# EAGLE schematic Masters Project (EAGLE 9.4.2), part 2 of 2
## Sheet 25 of 35: Gerber: Board Outline
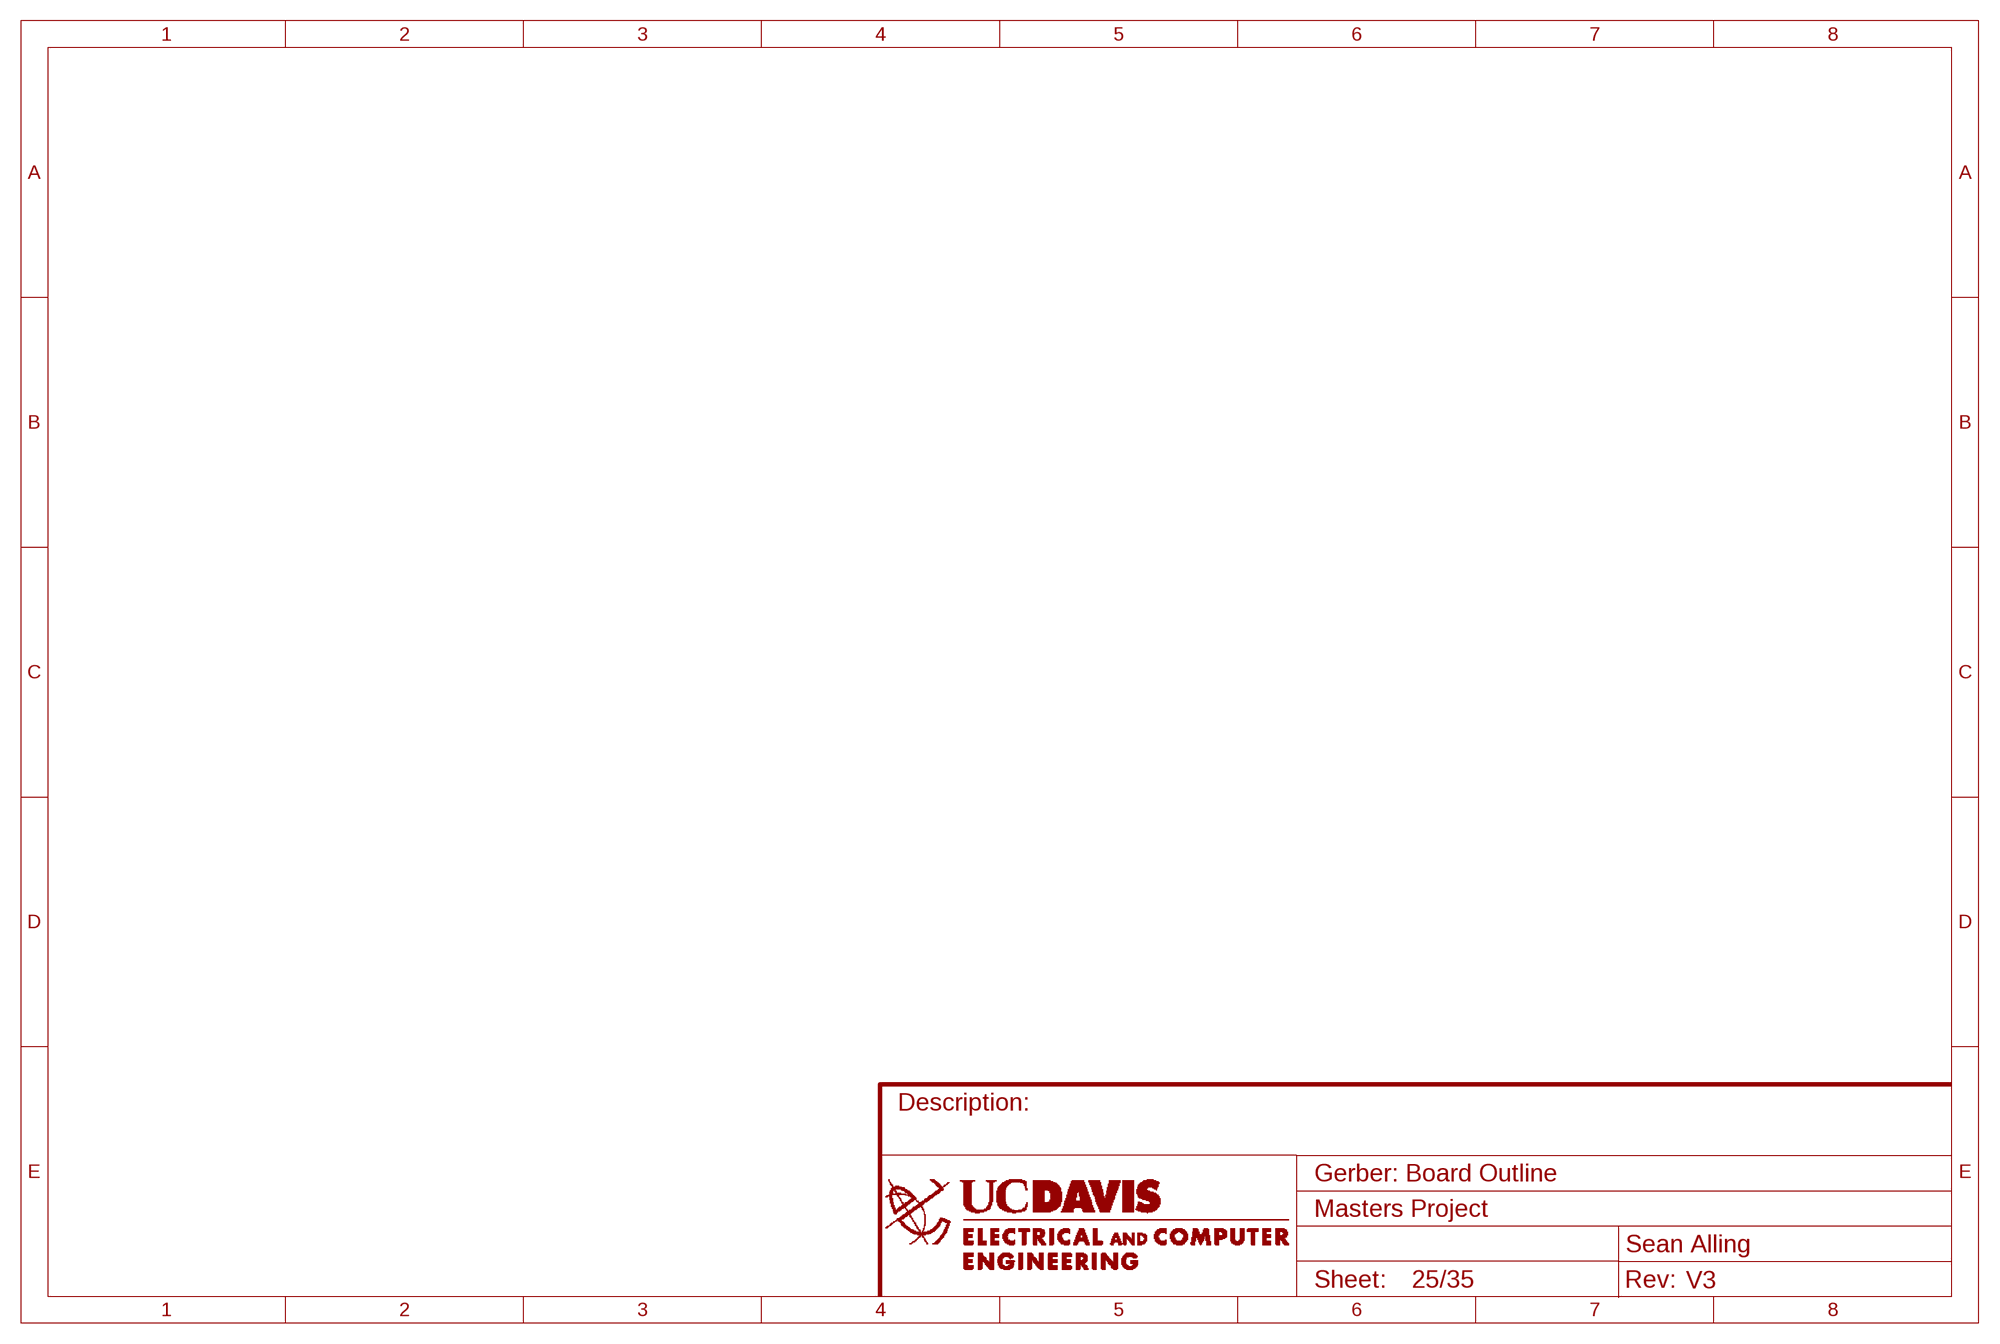
[diagram p24: schematic, sheet 25]

## Sheet 26 of 35: Gerber: Top Copper
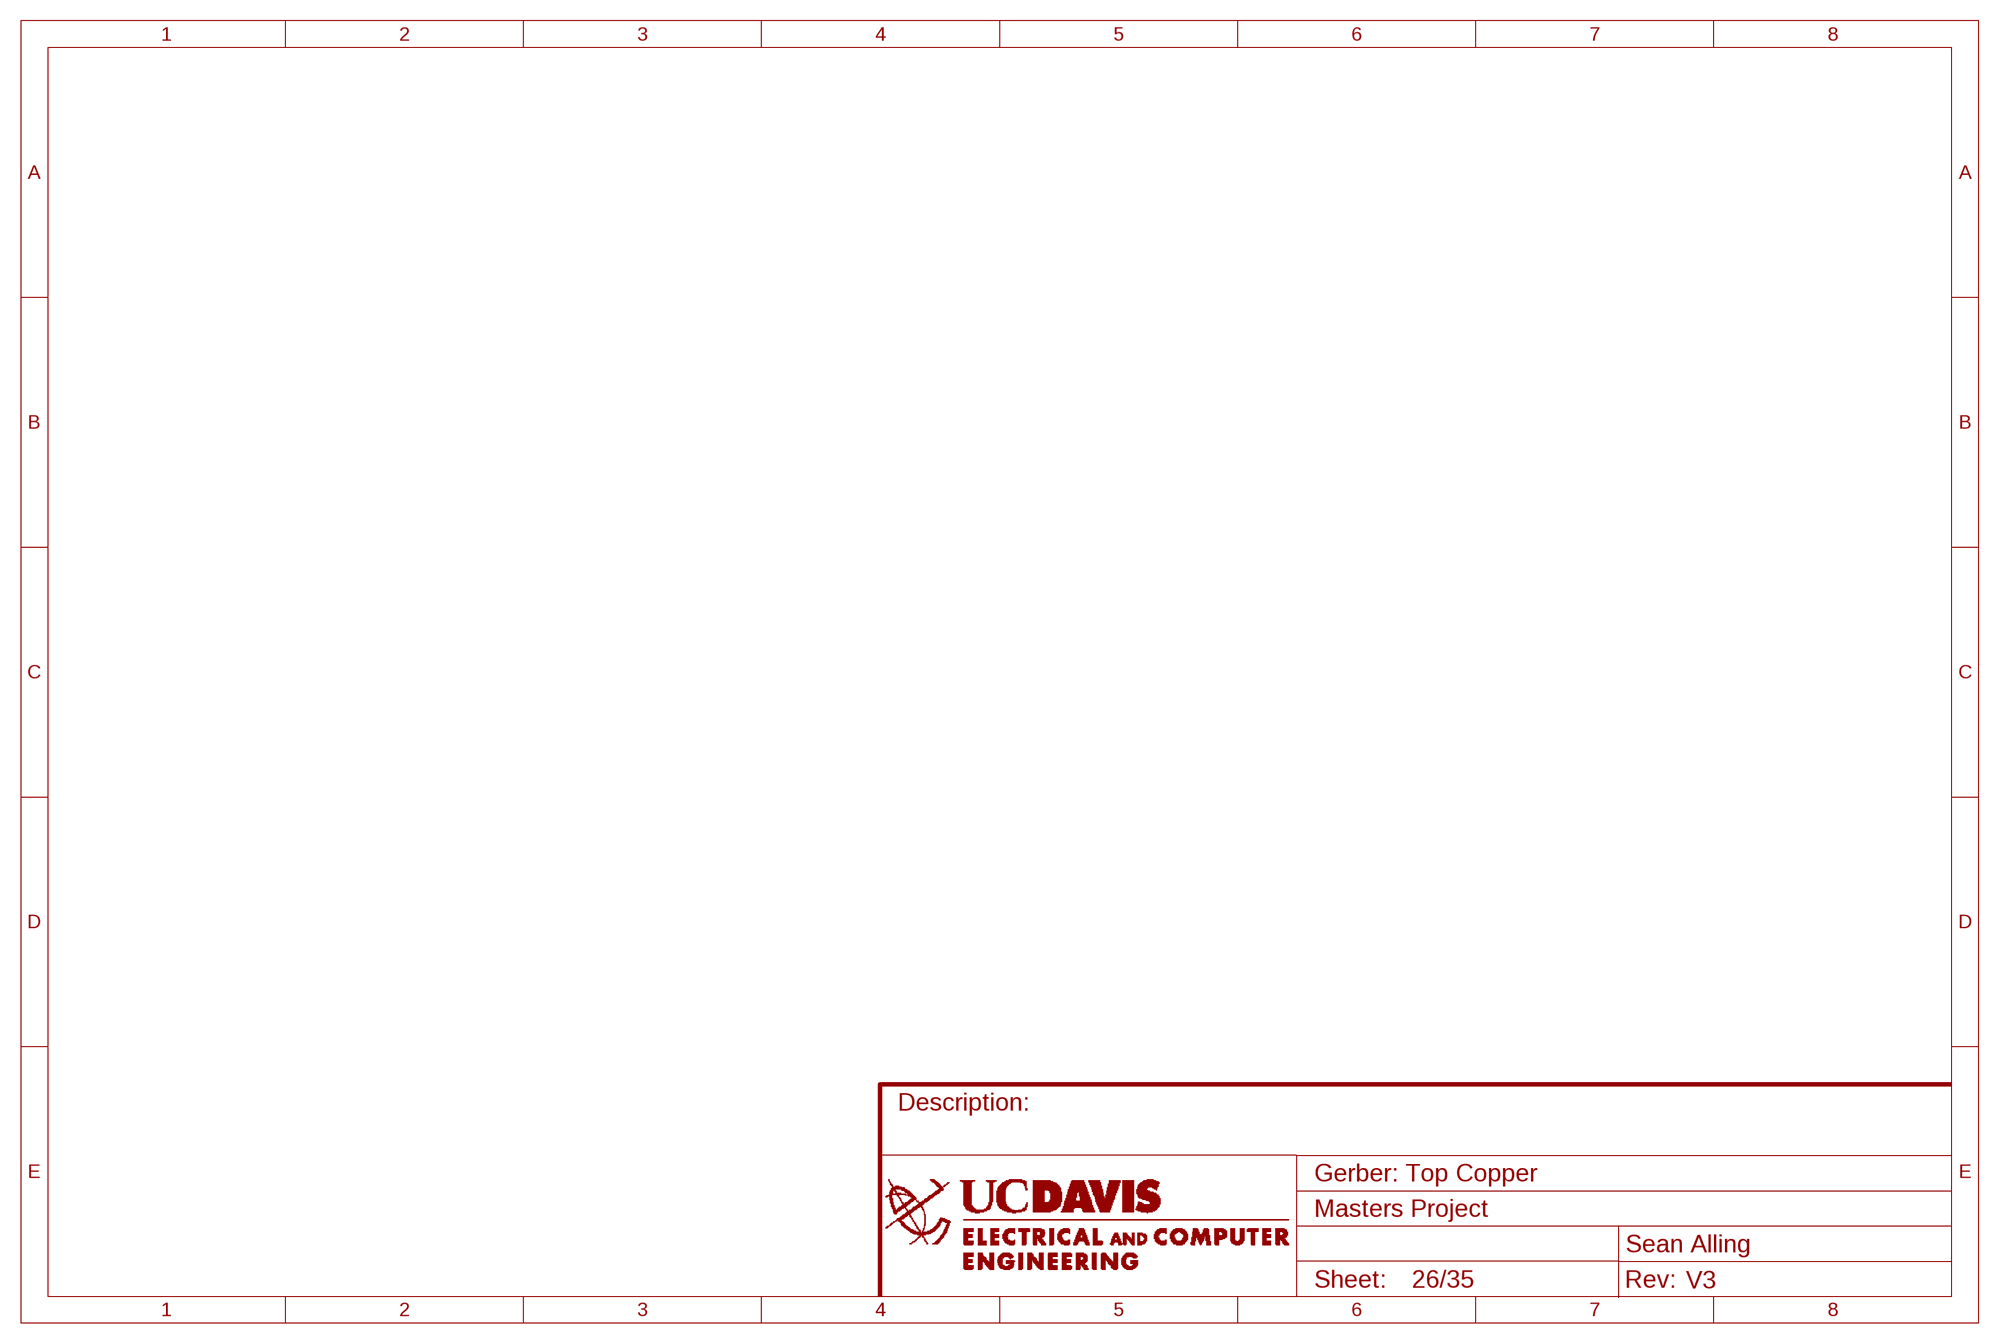
[diagram p25: schematic, sheet 26]

## Sheet 27 of 35: Gerber: Bottom Copper
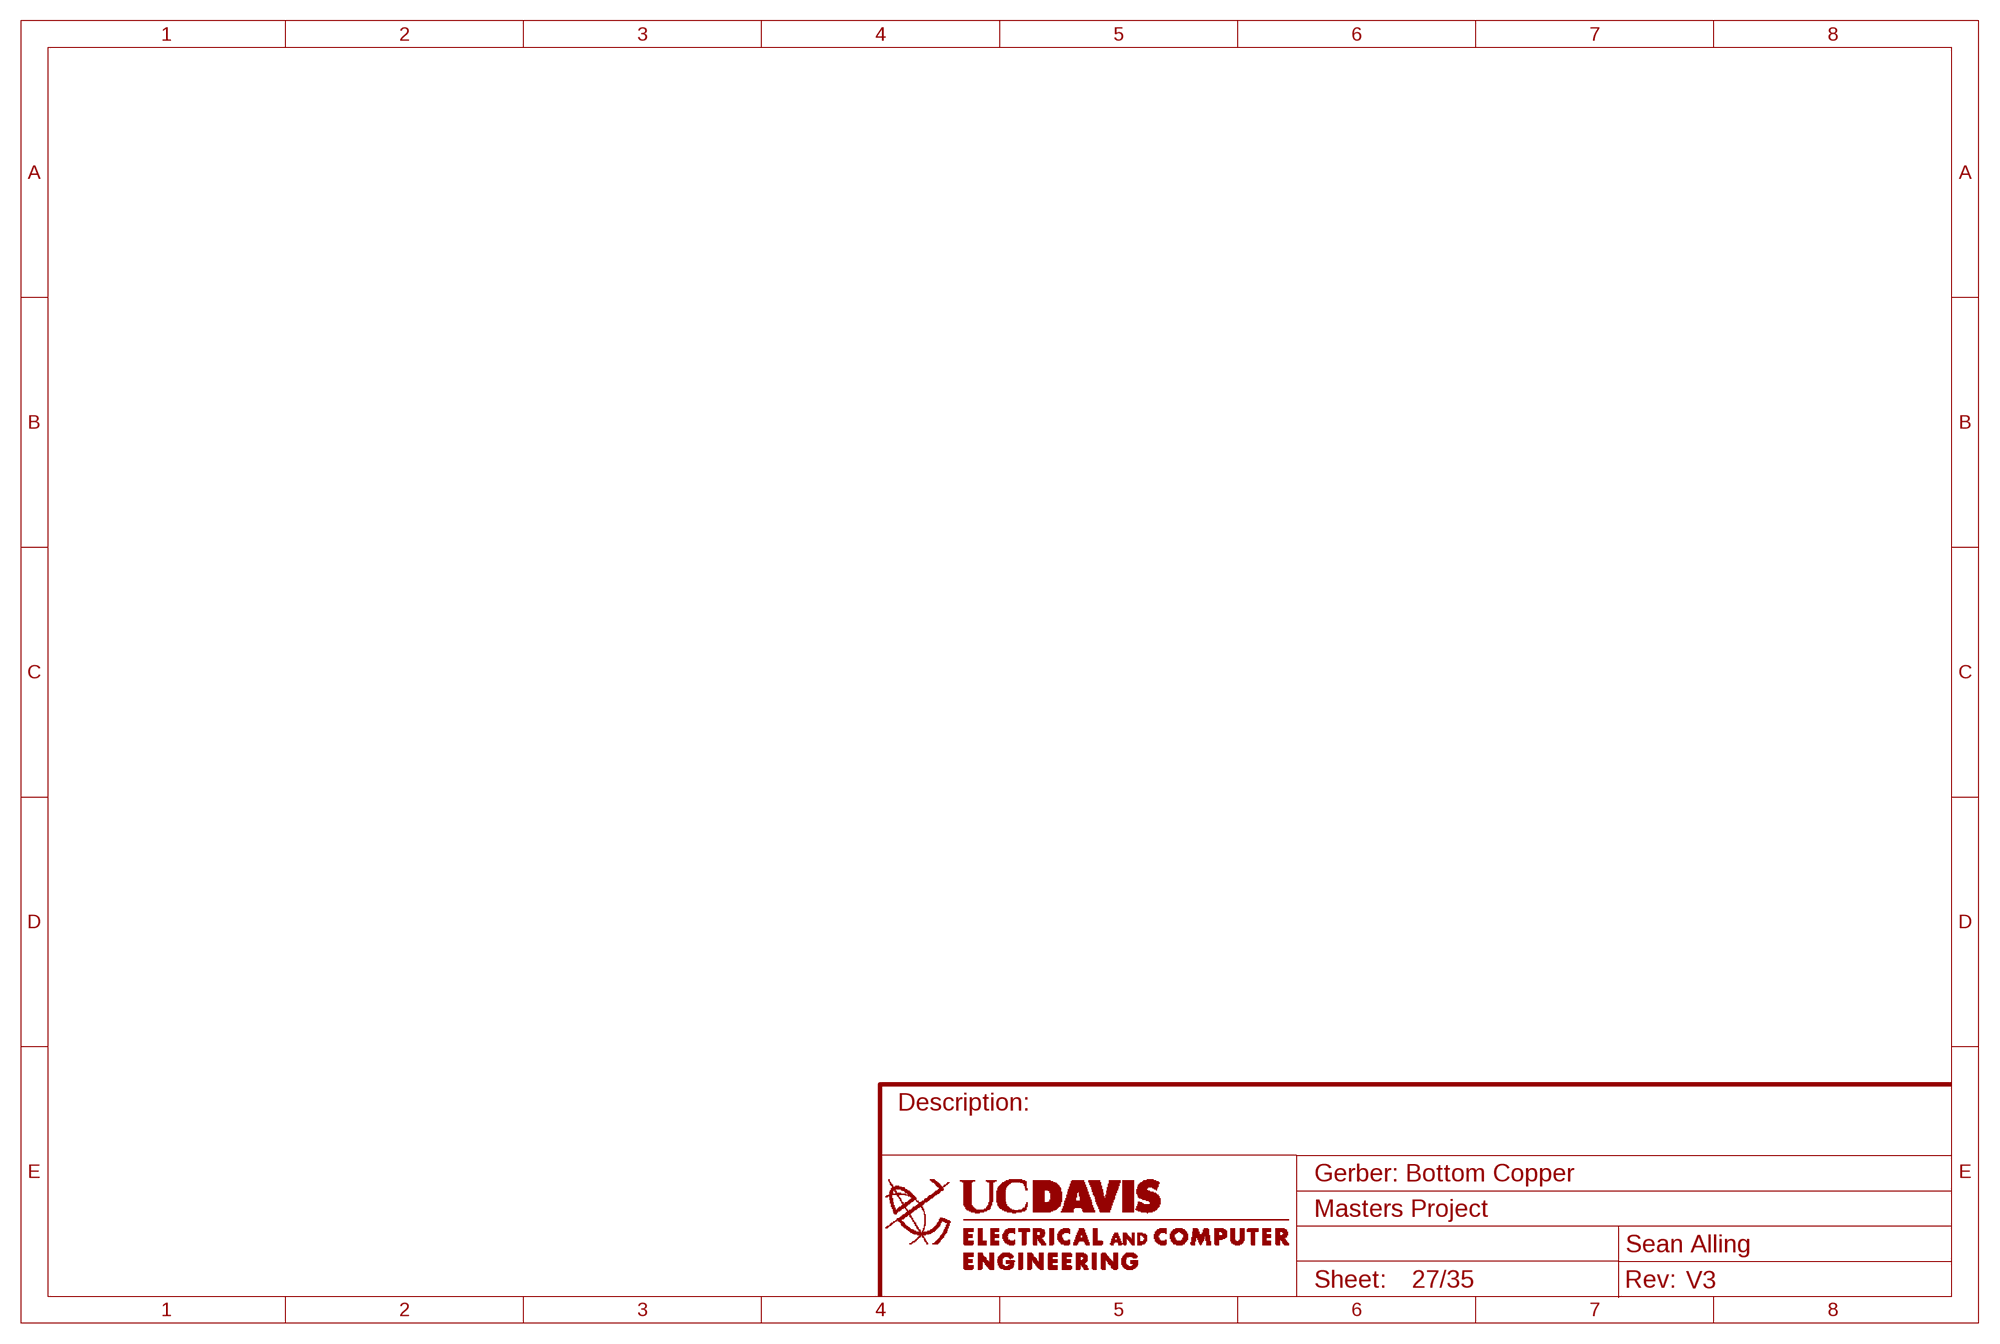
[diagram p26: schematic, sheet 27]

## Sheet 28 of 35: Gerber: Top Silkscreen
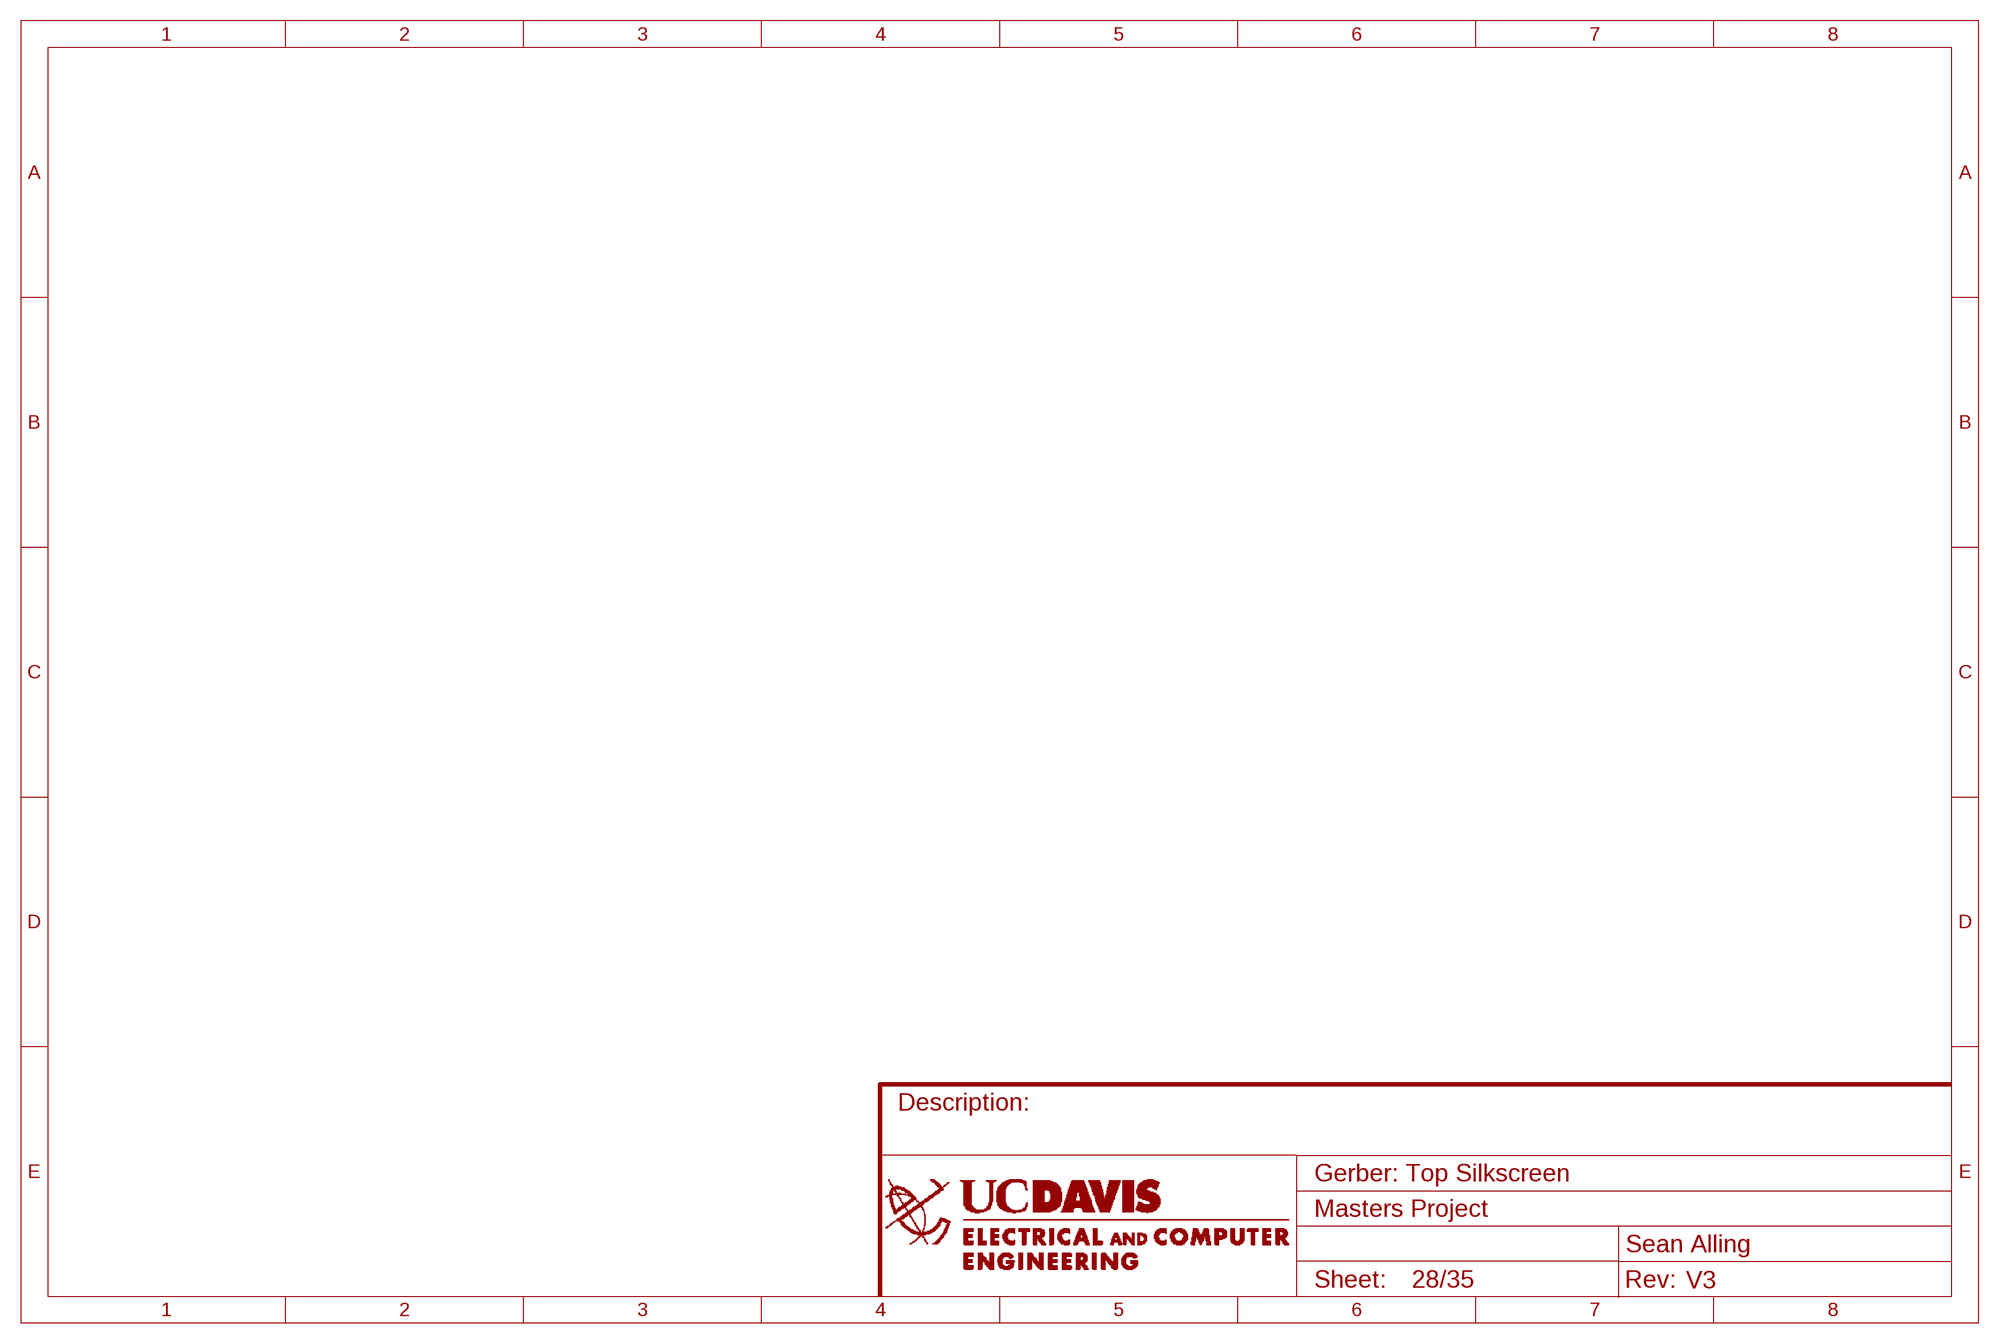
[diagram p27: schematic, sheet 28]

## Sheet 29 of 35: Gerber: Bottom Silkscreen
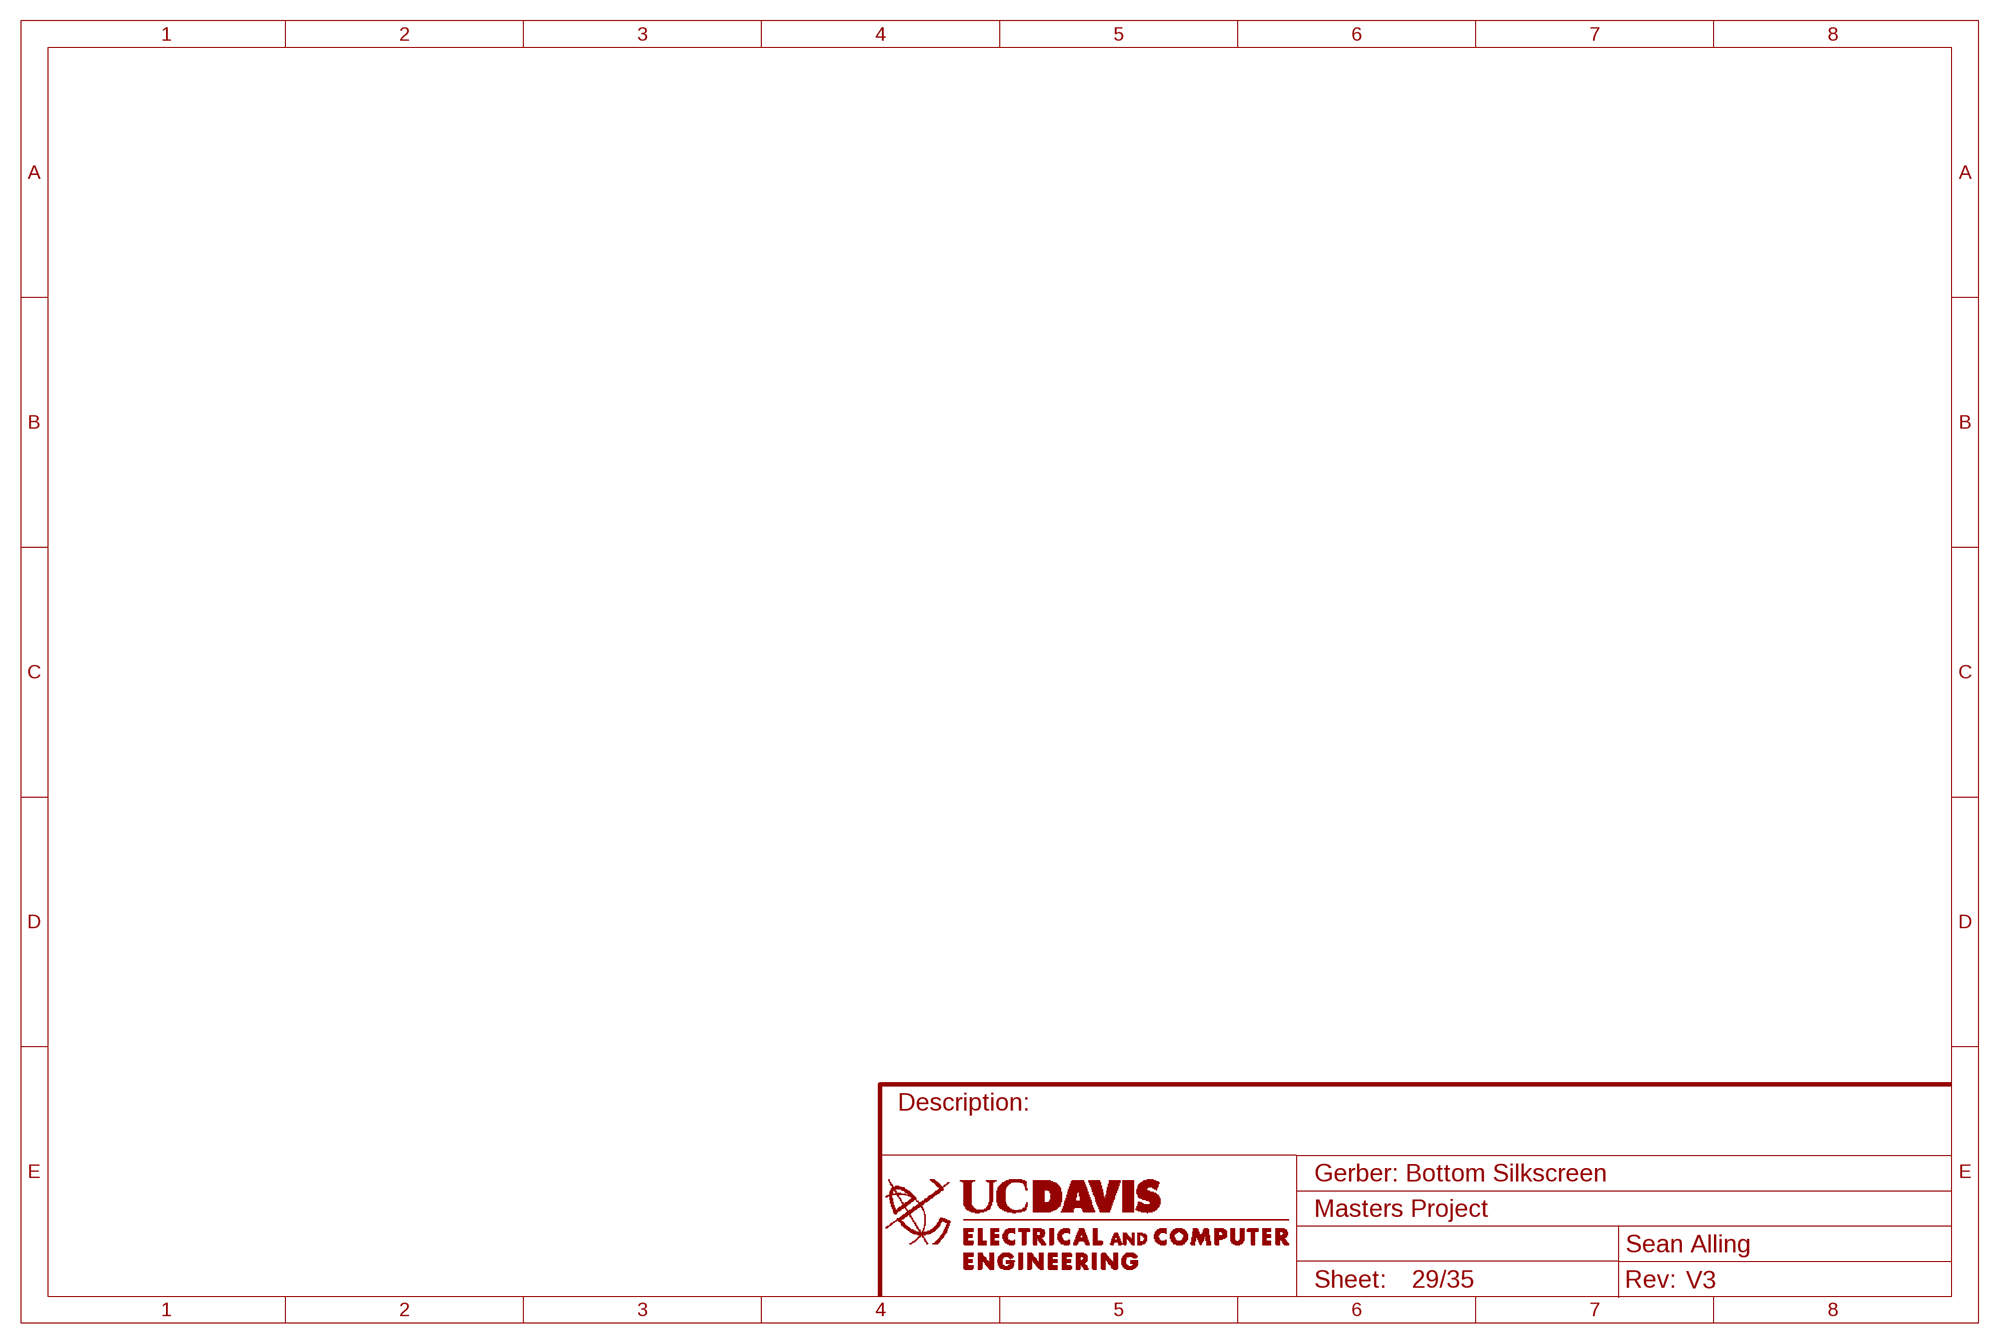
[diagram p28: schematic, sheet 29]

## Sheet 30 of 35: Gerber: Top Soldermask
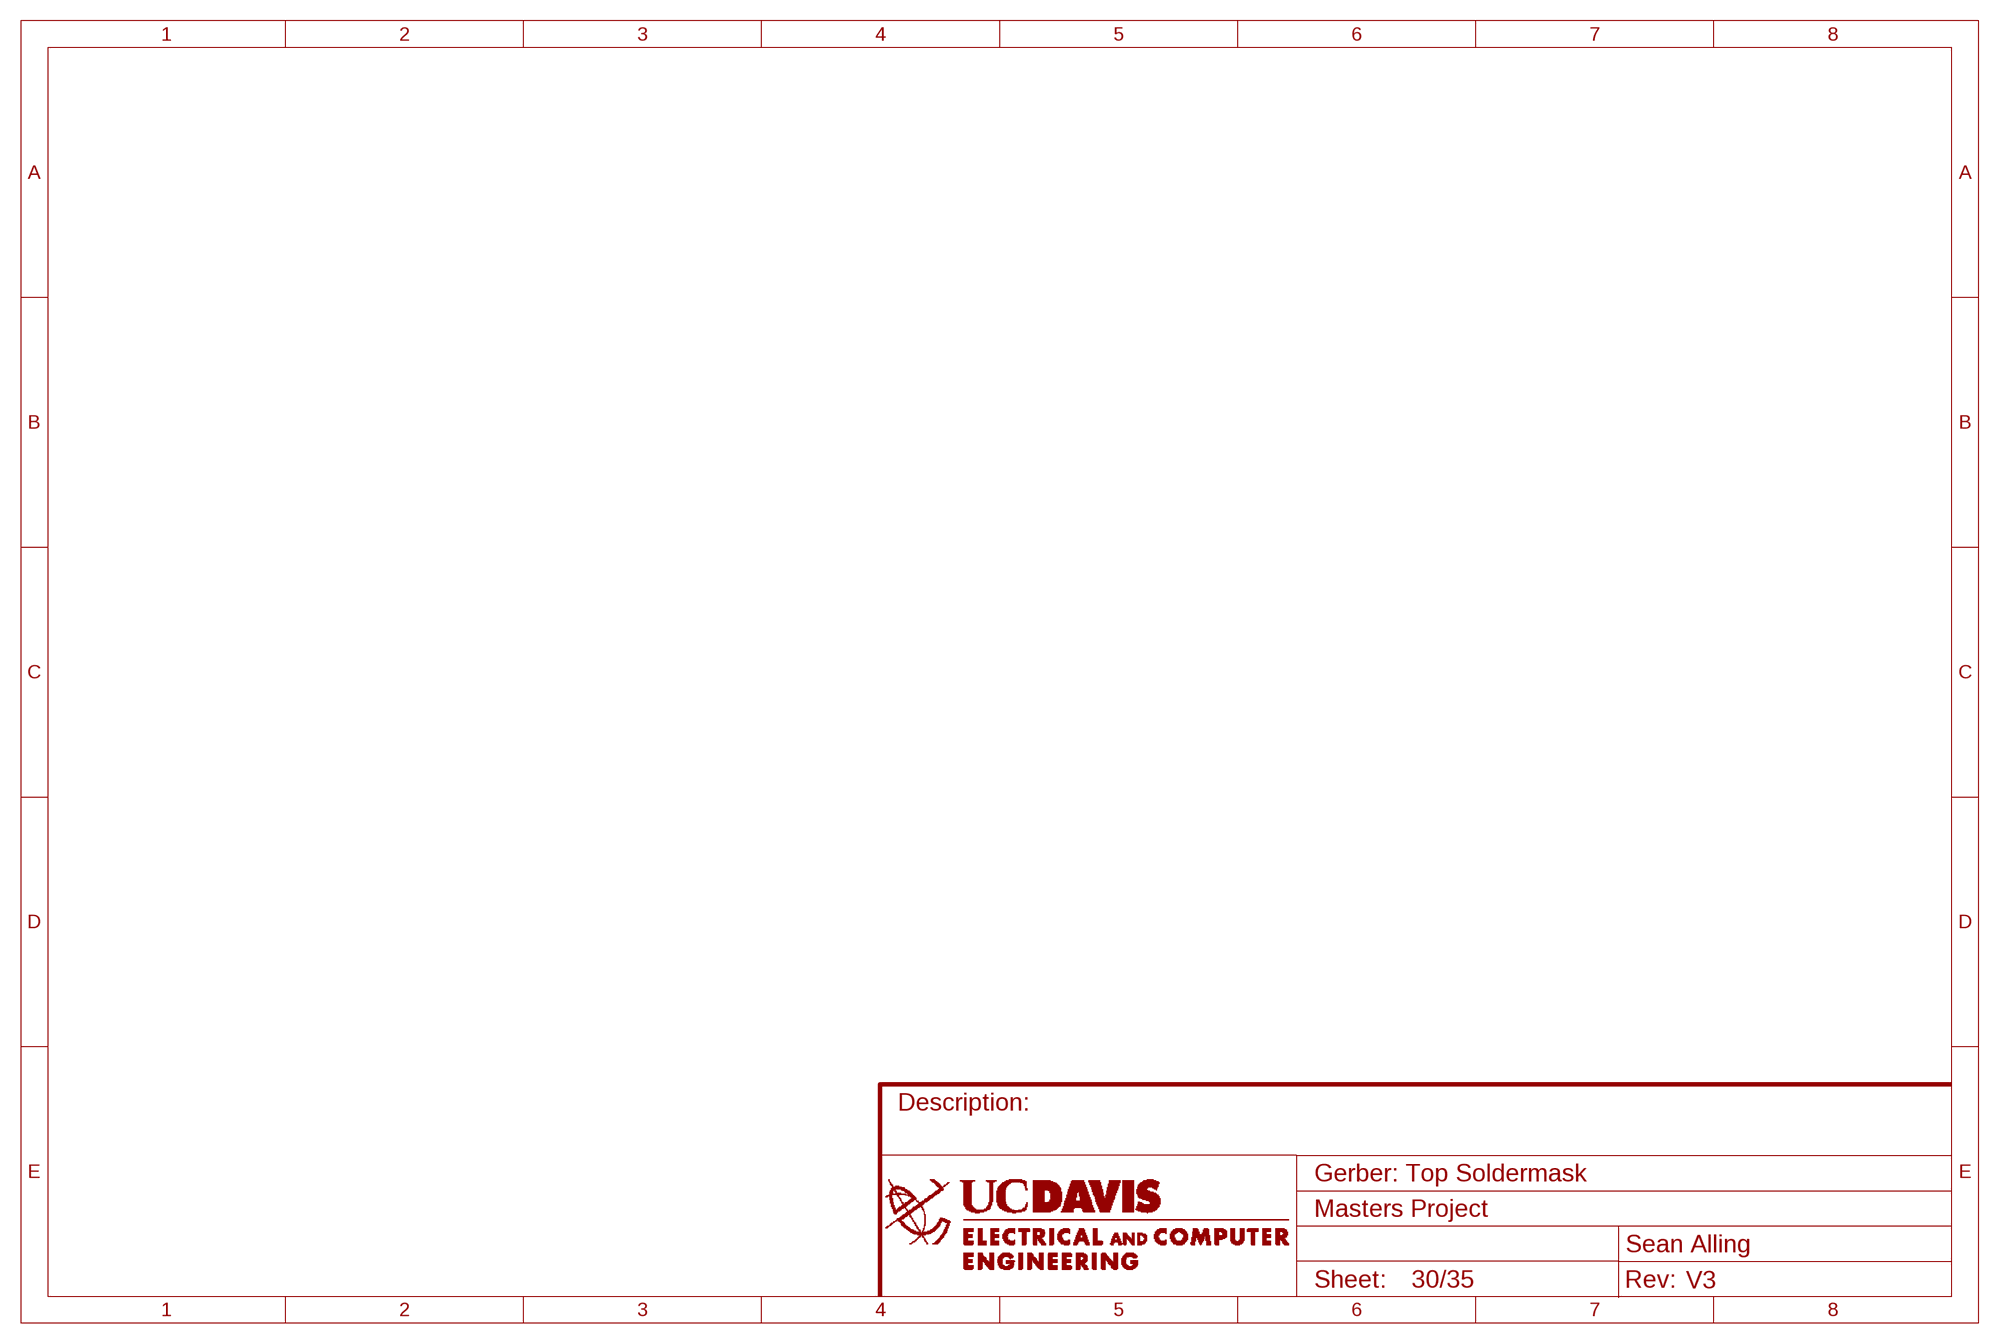
[diagram p29: schematic, sheet 30]

## Sheet 31 of 35: Gerber: Bottom Soldermask
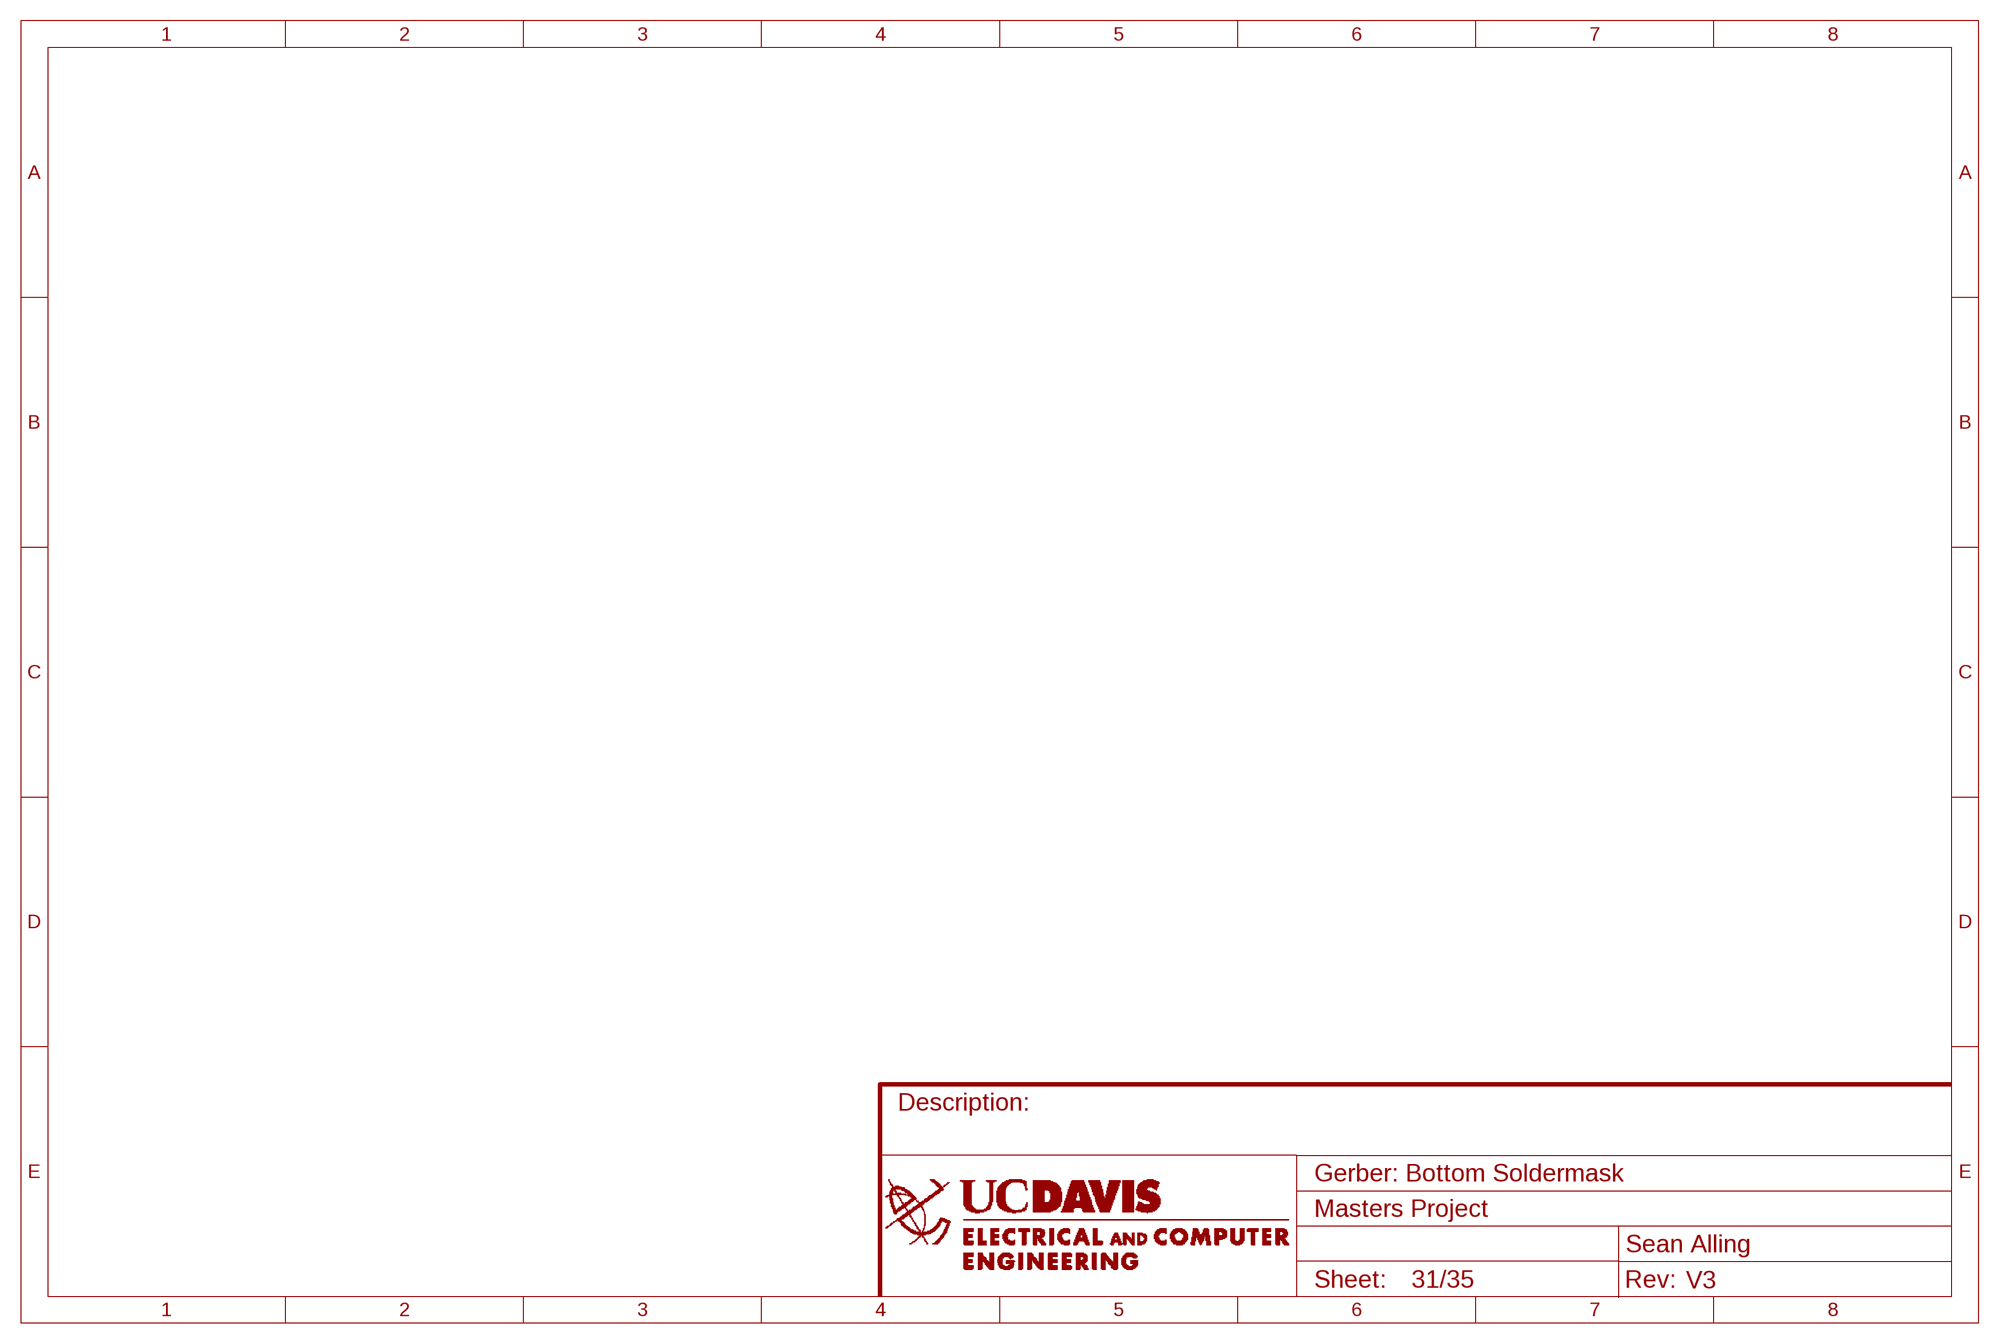
[diagram p30: schematic, sheet 31]

## Sheet 32 of 35: Gerber: Top Paste
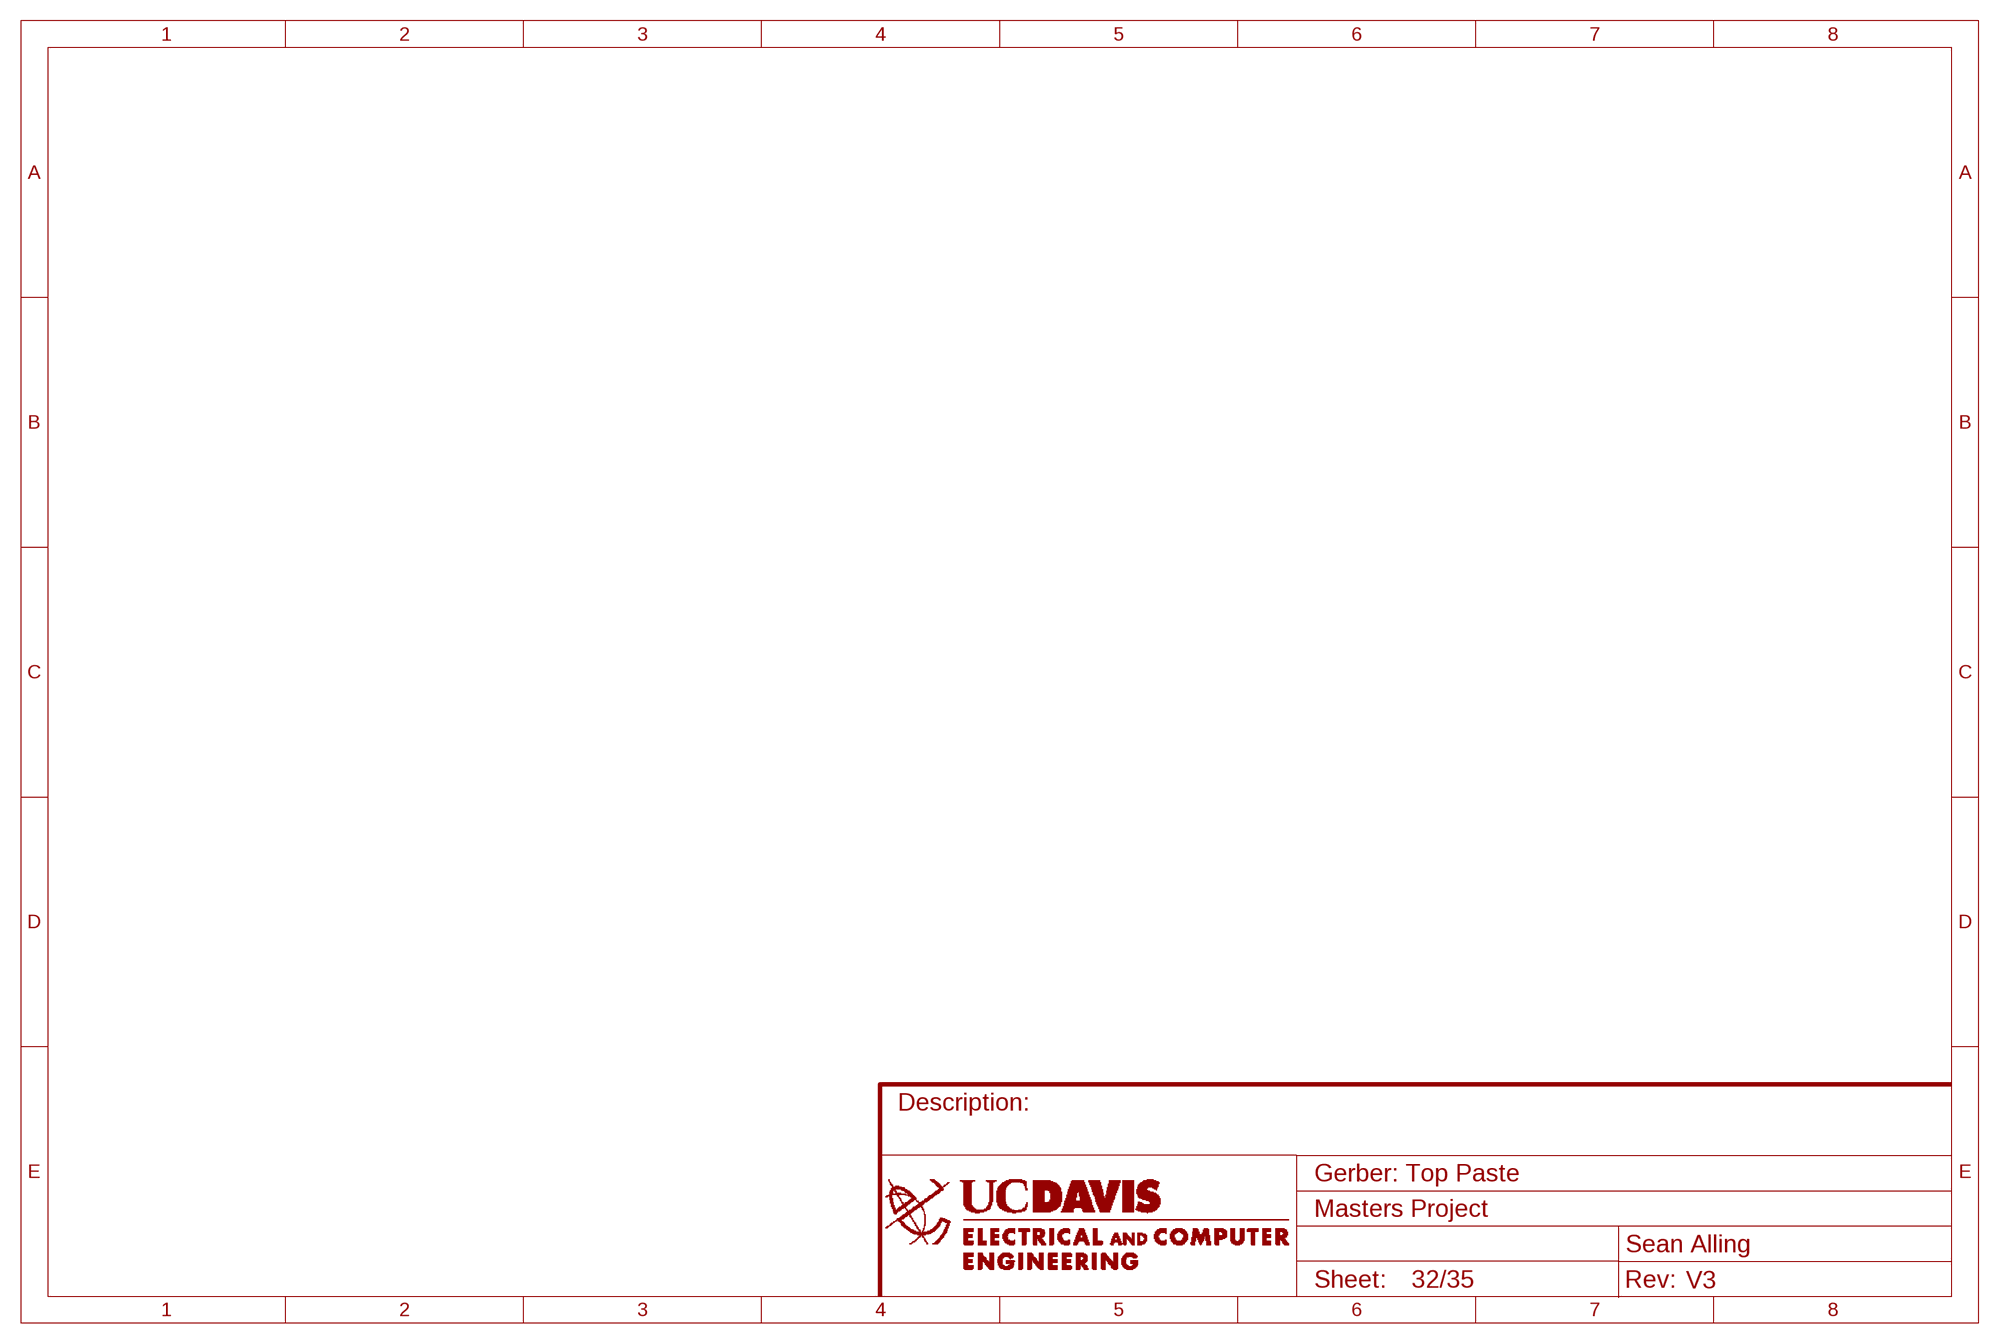
[diagram p31: schematic, sheet 32]

## Sheet 33 of 35: Gerber: Bottom Paste
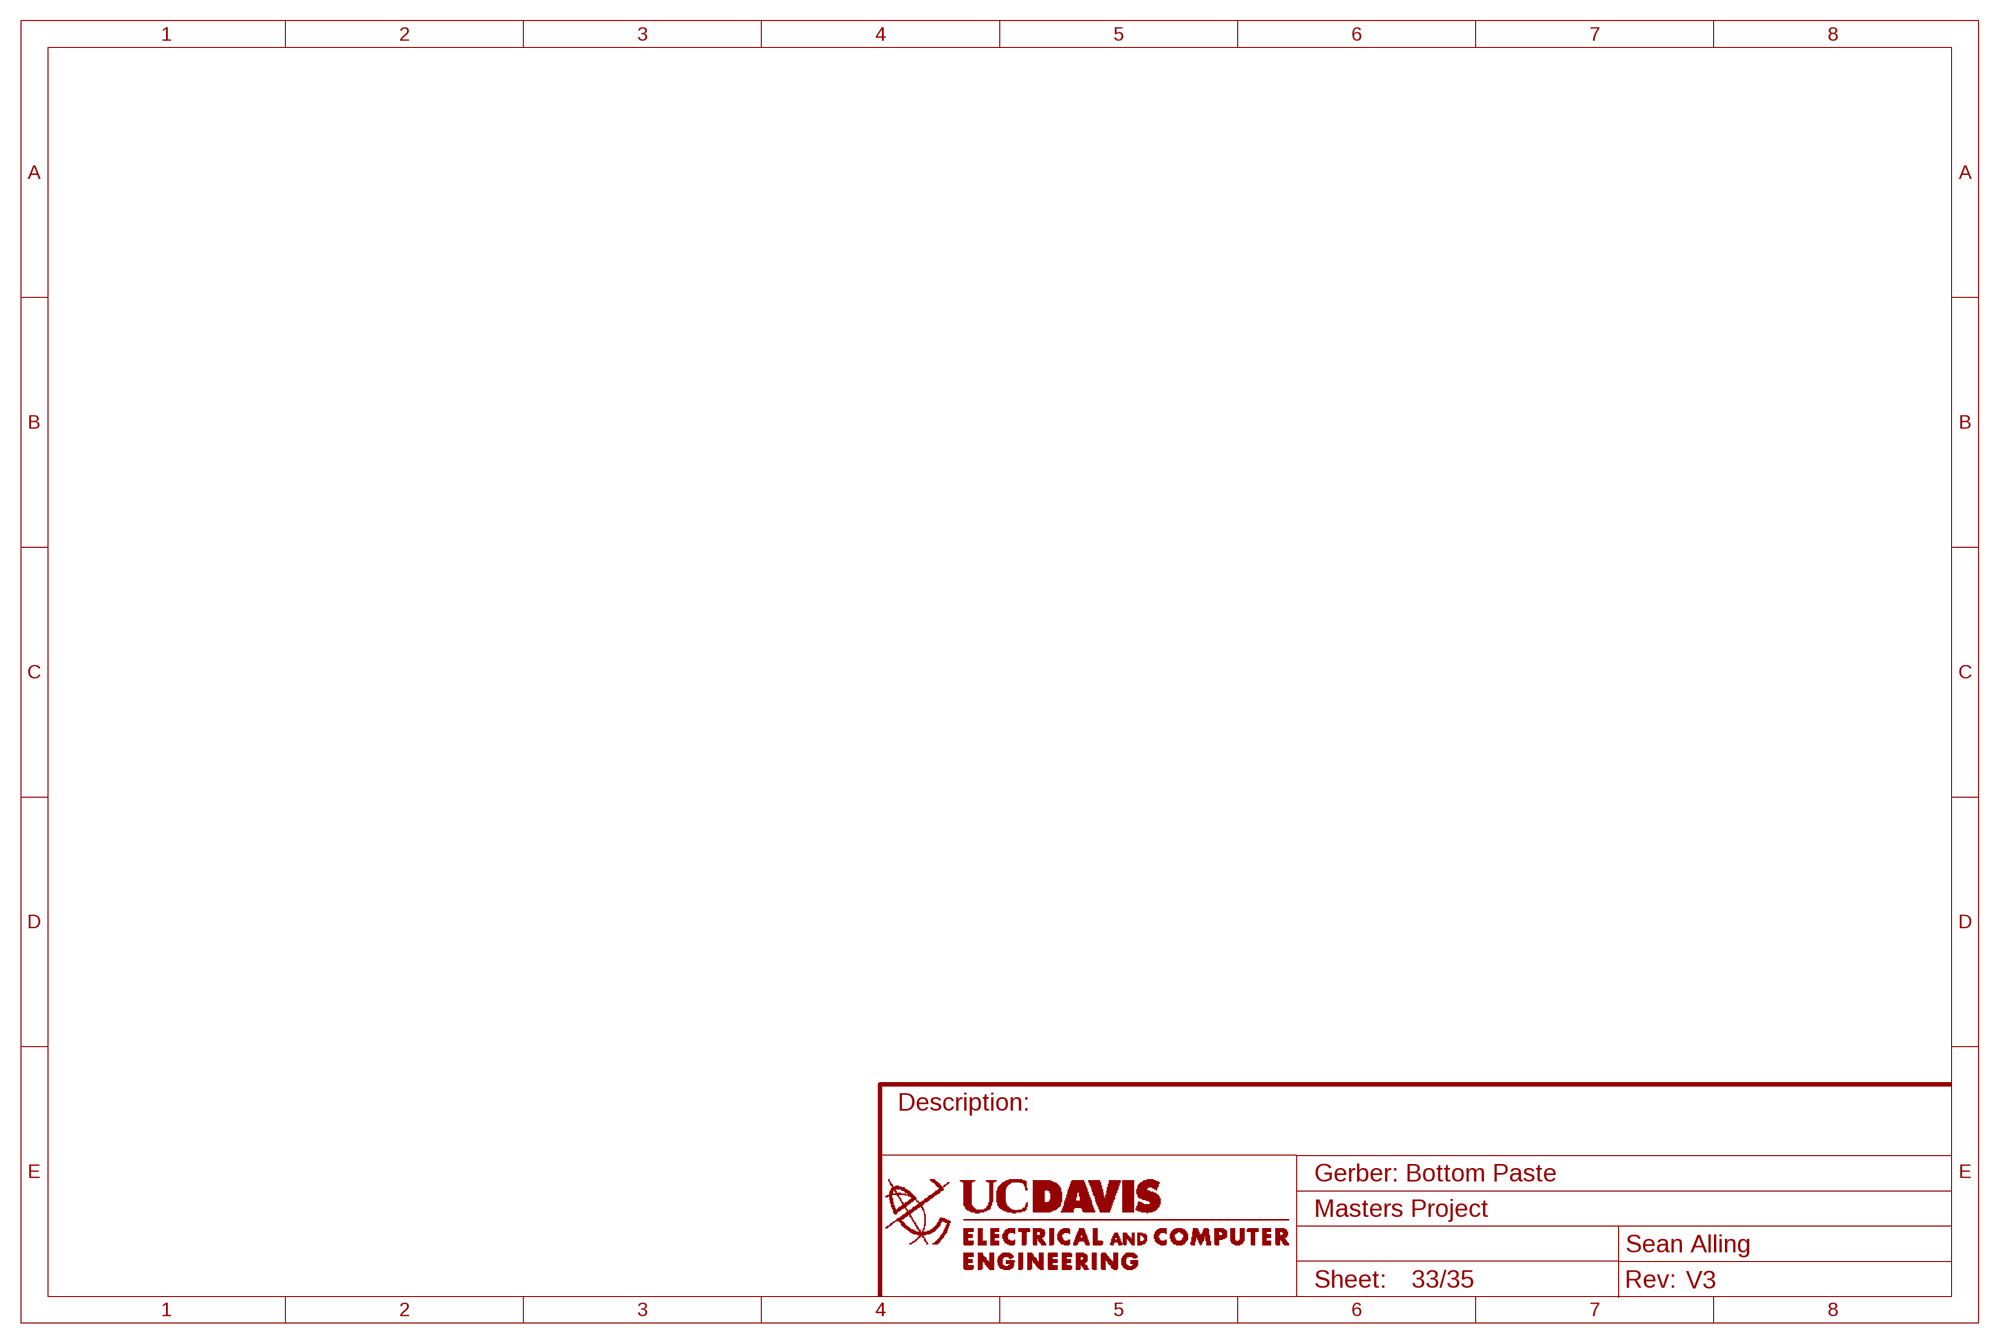
[diagram p32: schematic, sheet 33]

## Sheet 34 of 35: Drills: PTH & NPTH
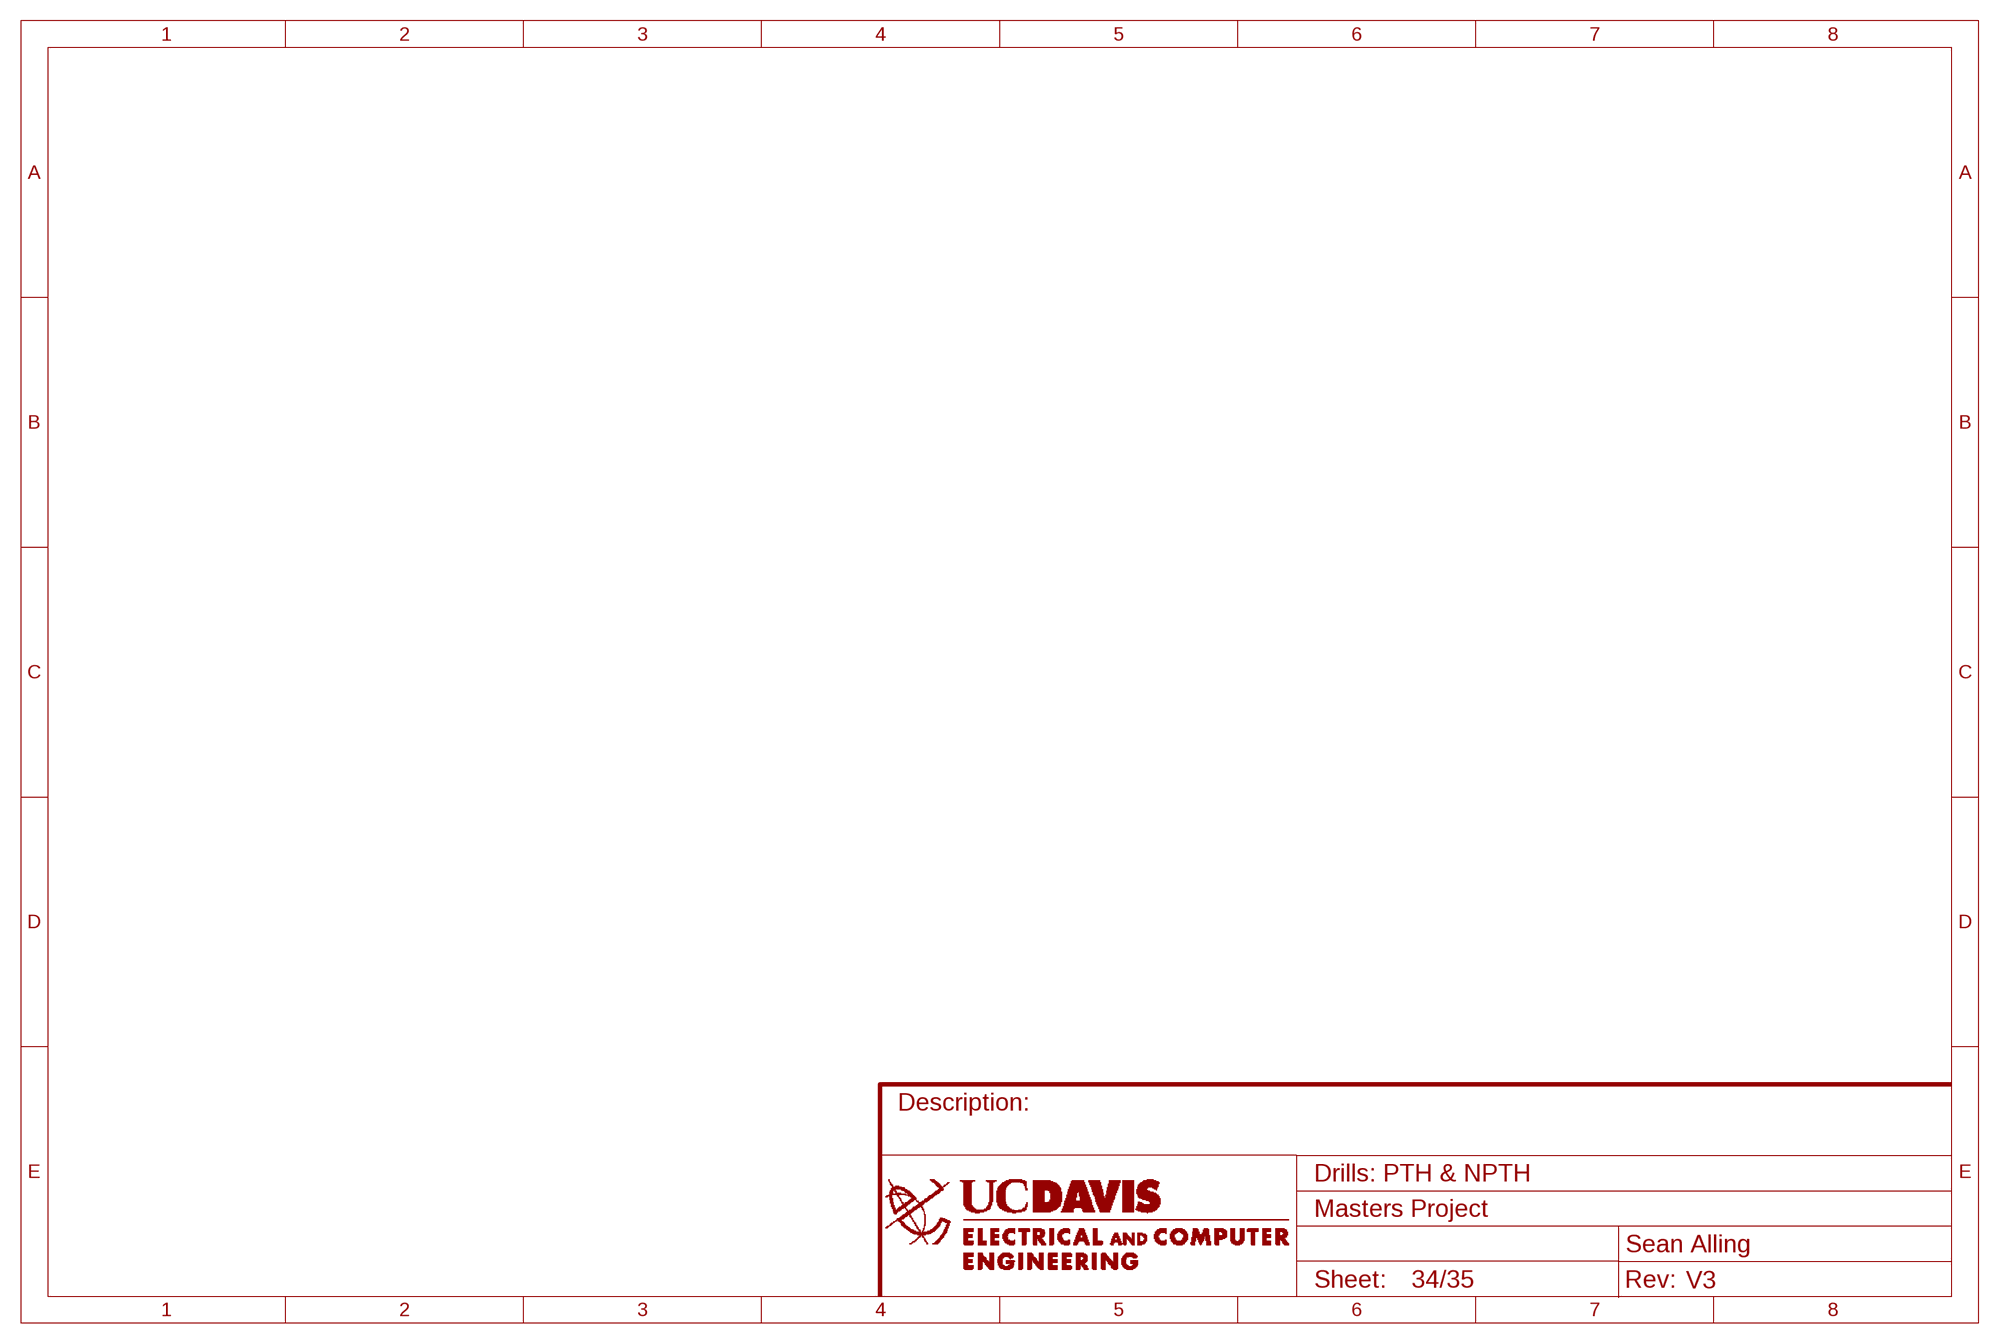
[diagram p33: schematic, sheet 34]

## Sheet 35 of 35: Sponsors
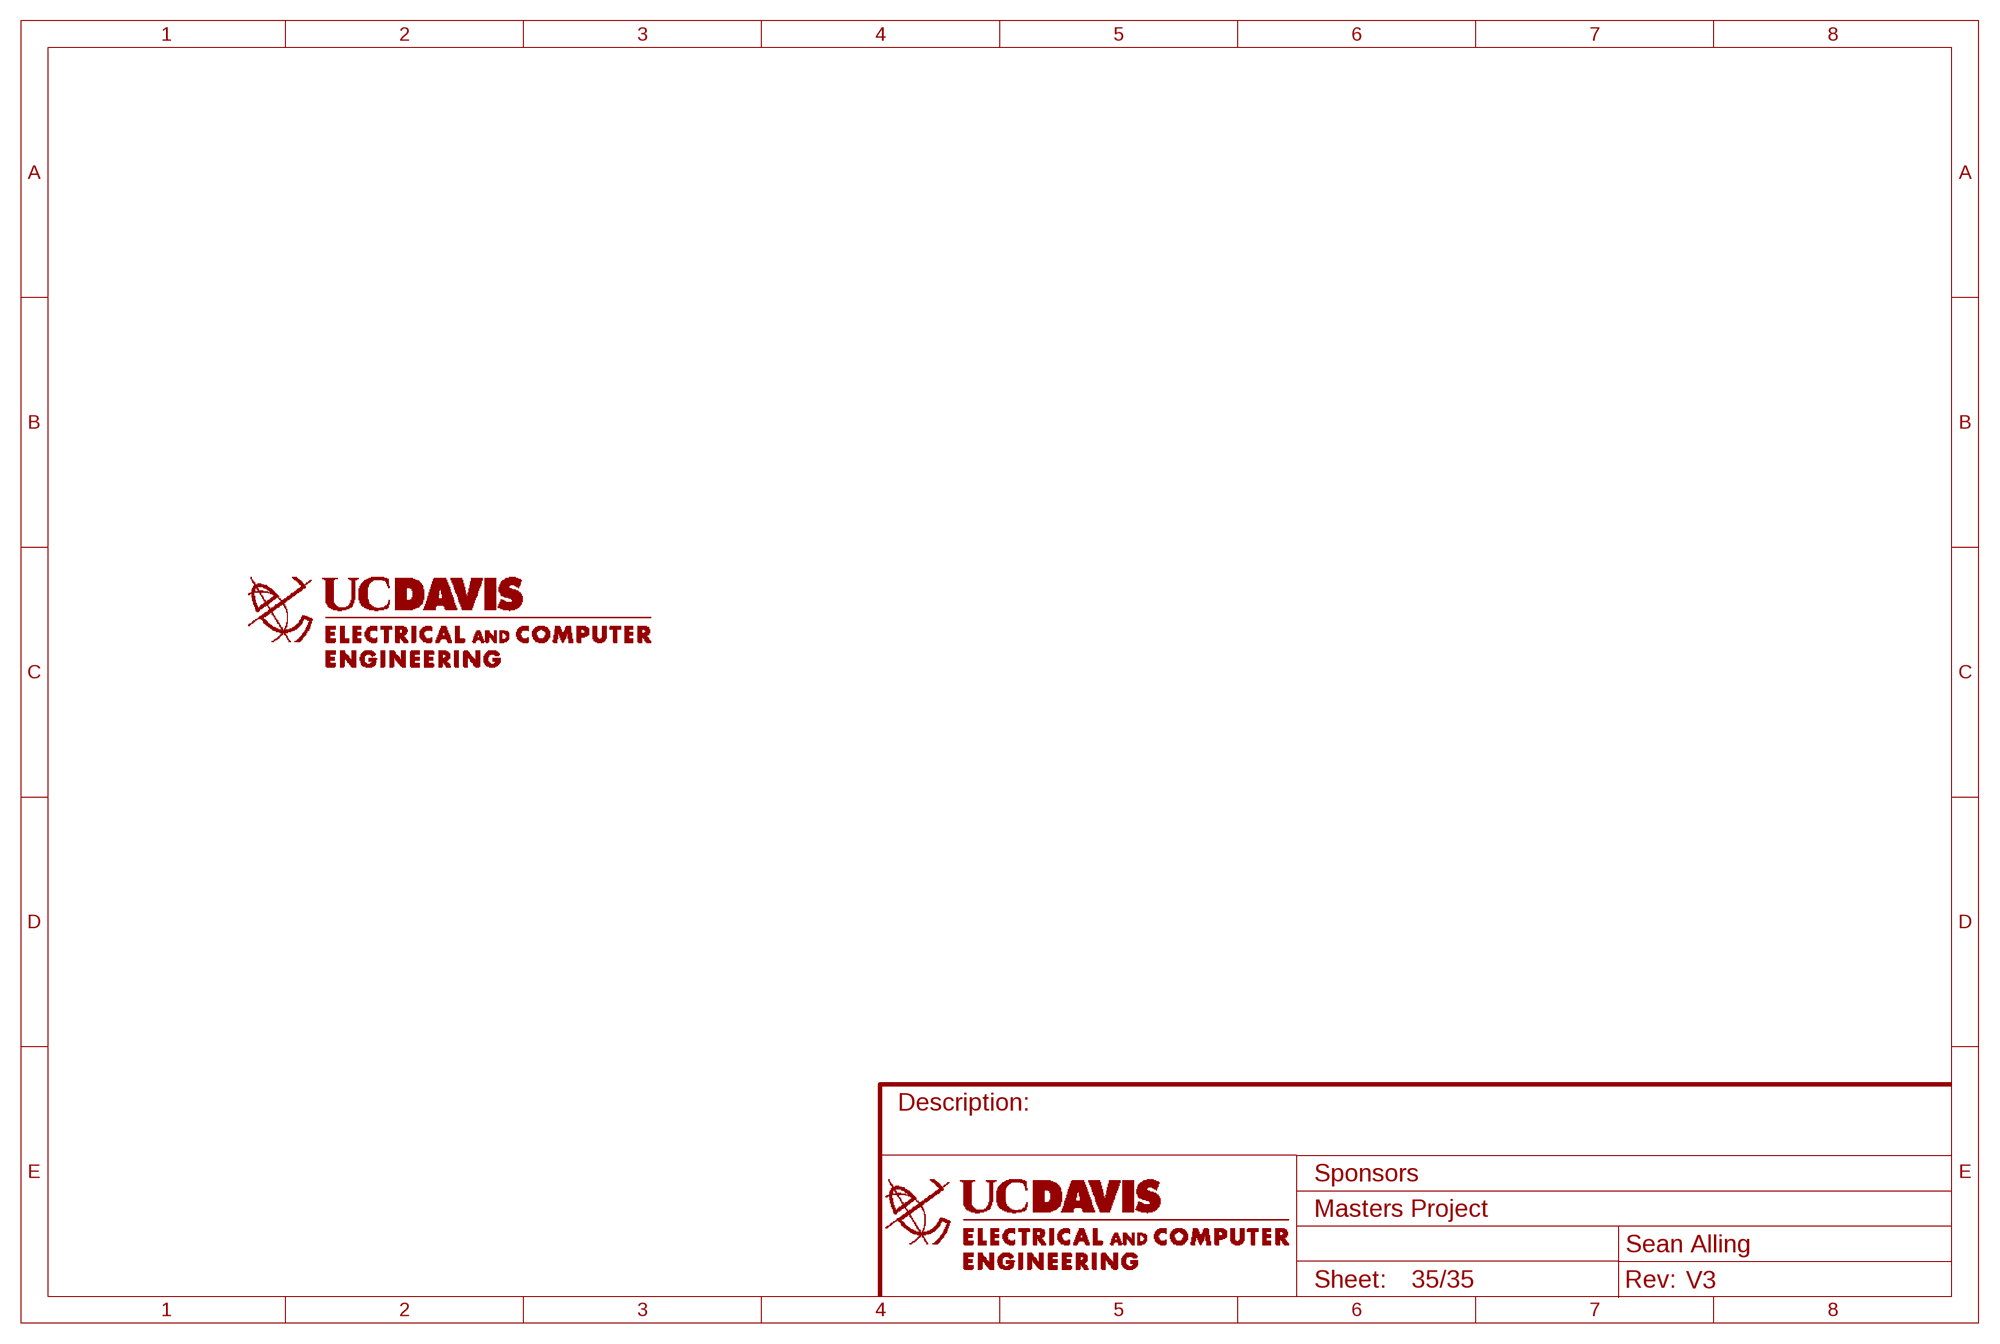
[diagram p34: schematic, sheet 35]

## Library data of the parts
C1 C2 C36 C39-C41 C44 C45 C48 C49 C52 = rcl:C-US: CAPACITOR, American symbol; SPICEPREFIX: C
C3 C4 C28 C30 C32 C34 = rcl:C-US: CAPACITOR, American symbol; PARTNO: CL21A475KBQNNNE
C5-C18 = rcl:C-US: CAPACITOR, American symbol; PARTNO: CC0805ZKY5V9BB105
C19 = rcl:C-US: CAPACITOR, American symbol; PARTNO: 08055C104KAT2A; SPICEPREFIX: C
C20 = rcl:C-US: CAPACITOR, American symbol; PARTNO: CC0603ZRY5V9BB104; SPICEPREFIX: C
C21 = rcl:C-US: CAPACITOR, American symbol; PARTNO: 08053F102K4T2A
C22-C25 C53 = rcl:C-US: CAPACITOR, American symbol; PARTNO: C0805C220J5GACTU
C26 C29 C31 C33 C35 = rcl:C-US: CAPACITOR, American symbol; PARTNO: CC0603ZRY5V9BB104
C27 = rcl:C-US: CAPACITOR, American symbol; PARTNO: C0805C395K8PACTU
C37 C38 C42 C43 C46 C47 C50 C51 C54 C55 = rcl:C-US: CAPACITOR, American symbol; PARTNO: 08055C104KAT2A
C57 = rcl:C-US: CAPACITOR, American symbol; PARTNO: GRM21BR61A476ME15L
C68 = rcl:C-US: CAPACITOR, American symbol; DK: 728-1067-1-ND; PACKAGE: 1210; SPICEPREFIX: C
D1 D3 D4 = MastersProjectV2:SCHOTTKY: DIODE small signal diode; MPN: MBR0530
D2 = SparkFun-DiscreteSemi:DIODE: Diode These are standard reverse protection diodes and small signal diodes. SparkFun Products: SparkFun SparkPunk Sound Kit <https://www.sparkfun.com/products/11177> SparkFun ESP8266 Thing <https://www.sparkfun.com/products/13231>; PROD_ID: DIO-09646
DISPLAY FPGA HDC1080 LED1 LED2 LED11 LED12 LED14-LED18 MCU MEMORY OPT3001 XBEE = LED:LED: LED OSRAM: - CHIPLED LG R971, LG N971, LY N971, LG Q971, LY Q971, LO R971, LY R971 LH N974, LH R974 LS Q976, LO Q976, LY Q976 LO Q996 - Hyper CHIPLED LW Q18S LB Q993, LB Q99A, LB R99A - SideLED LS A670, LO A670, LY A670, LG A670, LP A670 LB A673, LV A673, LT A673, LW A673 LH A674 LY A675 LS A676, LA A676, LO A676, LY A676, LW A676 LS A679, LY A679, LG A679 - Hyper Micro SIDELED® LS Y876, LA Y876, LO Y876, LY Y876 LT Y87S - SmartLED LW L88C, LW L88S LB L89C, LB L89S, LG L890 LS L89K, LO L89K, LY L89K LS L896, LA L896, LO L896, LY L896 - TOPLED LS T670, LO T670, LY T670, LG T670, LP T670 LSG T670, LSP T670, LSY T670, LOP T670, LYG T670 LG T671, LOG T671, LSG T671 LB T673, LV T673, LT T673, LW T673 LH T674 LS T676, LA T676, LO T676, LY T676, LB T676, LH T676, LSB T676, LW T676 LB T67C, LV T67C, LT T67C, LS T67K, LO T67K, LY T67K, LW E67C LS E67B, LA E67B, LO E67B, LY E67B, LB E67C, LV E67C, LT E67C LW T67C LS T679, LY T679, LG T679 LS T770, LO T770, LY T770, LG T770, LP T770 LB T773, LV T773, LT T773, LW T773 LH T774 LS E675, LA E675, LY E675, LS T675 LS T776, LA T776, LO T776, LY T776, LB T776 LHGB T686 LT T68C, LB T68C - Hyper Mini TOPLED® LB M676 - Mini TOPLED Santana® LG M470 LS M47K, LO M47K, LY M47K Source: http://www.osram.convergy.de LUXEON: - LUMILED® LXK2-PW12-R00, LXK2-PW12-S00, LXK2-PW14-U00, LXK2-PW14-V00 LXK2-PM12-R00, LXK2-PM12-S00, LXK2-PM14-U00 LXK2-PE12-Q00, LXK2-PE12-R00, LXK2-PE12-S00, LXK2-PE14-T00, LXK2-PE14-U00 LXK2-PB12-K00, LXK2-PB12-L00, LXK2-PB12-M00, LXK2-PB14-N00, LXK2-PB14-P00, LXK2-PB14-Q00 LXK2-PR12-L00, LXK2-PR12-M00, LXK2-PR14-Q00, LXK2-PR14-R00 LXK2-PD12-Q00, LXK2-PD12-R00, LXK2-PD12-S00 LXK2-PH12-R00, LXK2-PH12-S00 LXK2-PL12-P00, LXK2-PL12-Q00, LXK2-PL12-R00 Source: www.luxeon.com KINGBRIGHT: KA-3528ASYC Source: www.kingbright.com; PARTNO: LG R971-KN-1
FD1-FD8 = SparkFun-Aesthetics:FIDUCIAL: Fiducial Alignment Points Point-of-reference for pick-and-place machines and other optical instruments.
H1-H4 = SparkFun-Hardware:STAND-OFF: Stand Off Drill holes for mechanically mounting via screws, standoffs, etc. Note: Use the keepout ring to avoid running the screw head into surrounding components. Variant Overviews STAND-OFF - Mechanical footprint for a #4 phillips button head screw. STAND-OFF-TIGHT - Mechanical footprint for a #4 phillips button head screw, Example SparkFun Products Screw - Phillips Head (1/4", 4-40, 10 pack) <https://www.sparkfun.com/products/10453> (PRT-10453) Screw - Phillips Head (1/2", 4-40, 10 pack) <https://www.sparkfun.com/products/10452> (PRT-10452) Screw - Phillips Head (3/4", 4-40, 10 pack) <https://www.sparkfun.com/products/10451> (PRT-10451) Screw - Phillips Head (1", 4-40, 10 pack) <https://www.sparkfun.com/products/10450> (PRT-10450)
J1 = SparkFun-Connectors:JST_2MM_MALE: JST 2MM MALE RA CONNECTOR Two pin, compact surface mount connector. Commonly used as a battery input connection point. We really like the solid locking feeling and high current rating on these small connectors. We use these all the time as battery connectors. Mates to single-cell LiPo batteries. Here is the connector we sell at SparkFun: JST Right Angle Connector - White <https://www.sparkfun.com/products/8612> (PRT-08612) Datasheet <http://www.sparkfun.com/datasheets/Prototyping/Connectors/JST-Horizontal.pdf> It was used on these SparkFun products: SparkFun MOSFET Power Controller <https://www.sparkfun.com/products/11214> (PRT-11214) SparkFun Battery Babysitter - LiPo Battery Manager <https://www.sparkfun.com/products/13777> (PRT-13777) And many, many others that required a lipo battery connection.; PARTNO: S2B-PH-SM4-TB(LF)(SN); PROD_ID: CONN-11443; SF_ID: PRT-08612
JP1 JP3 JP4 = MastersProject:2X5_HEADER
JP2 = MastersProject:1X3_HEADER; PARTNO: PRPC040SAAN-RC
JP12 = MastersProject:CORTEX_DEBUG_10PIN; PARTNO: 3220-10-0100-00
JP26 = SparkFun-RF:XBEE-1: Xbee module footprints; PARTNO: NPPN101BFCN-RC
L1 = MastersProject:L-US; PARTNO: BRC2012T4R7MD
L2 = MastersProjectV2:L_US
Q1 = MastersProject:CPFBZ-A2C4-32.768KD6; PARTNO: CPFBZ-A2C4-32.768KD6
Q2 = MastersProject:ABM8-48.000MHZ-B2-T; PARTNO: ABM8-48.000MHZ-B2-T
Q3 = MastersProjectV2:MOSFET-NCH: N-channel MOSFETs Voltage controlled devices that allow control of high current outputs. SparkFun Products: SparkFun OpenScale <https://www.sparkfun.com/products/13261> SparkFun Digital Sandbox <https://www.sparkfun.com/products/12651> SparkFun Monster Moto Shield <https://www.sparkfun.com/products/10182> SparkFun MOSFET Power Controller <https://www.sparkfun.com/products/11214>; MPN: IRLML6346TRPBF
Q9 = MastersProjectV2:ABS07-LR
R1-R3 = rcl:R-US_: RESISTOR, American symbol; SPICEPREFIX: R
R6-R14 R17 = rcl:R-US_: RESISTOR, American symbol; PARTNO: RMCF0805JT330R
R16 R35 = rcl:R-US_: RESISTOR, American symbol; PARTNO: RC0805FR-072KL
R18 R20 R27 R37-R41 = rcl:R-US_: RESISTOR, American symbol; PARTNO: RC0805JR-071KL
R24 R25 = rcl:R-US_: RESISTOR, American symbol; PARTNO: RMCF0805JT10K0
R26 = rcl:R-US_: RESISTOR, American symbol; PARTNO: RC0805JR-0791KL
R30-R32 = rcl:R-US_: RESISTOR, American symbol; PARTNO: RC0805FR-075K1L
SW1 = MastersProject:TACTILE-SWITCH; PARTNO: 7914G-1-000E
TP1 = testpad2:TP: Test pad; TP_SIGNAL_NAME: +BAT
TP2 TP11-TP18 = testpad2:TP: Test pad; TP_SIGNAL_NAME: GND
TP3 = testpad2:TP: Test pad; TP_SIGNAL_NAME: VCC_USB
TP4 = testpad2:TP: Test pad; TP_SIGNAL_NAME: VCC_HDC1080
TP5 = testpad2:TP: Test pad; TP_SIGNAL_NAME: VCC_OPT3001
TP6 = testpad2:TP: Test pad; TP_SIGNAL_NAME: VCC_FPGA
TP7 = testpad2:TP: Test pad; TP_SIGNAL_NAME: VCC_XBEE
TP8 = testpad2:TP: Test pad; TP_SIGNAL_NAME: VCC_MEMORY
TP9 = testpad2:TP: Test pad; TP_SIGNAL_NAME: VCC_DISPLAY
TP10 = testpad2:TP: Test pad; TP_SIGNAL_NAME: VCC_MCU
TP19 = testpad2:TP: Test pad; TP_SIGNAL_NAME: !RST
TP20 = testpad2:TP: Test pad; TP_SIGNAL_NAME: FREQ_HF
TP21 = testpad2:TP: Test pad; TP_SIGNAL_NAME: FREQ_LF
TP22 = testpad2:TP: Test pad; TP_SIGNAL_NAME: UART_TX_XBEE
TP23 = testpad2:TP: Test pad; TP_SIGNAL_NAME: UART_RX_XBEE
TP24 = testpad2:TP: Test pad; TP_SIGNAL_NAME: SPI_CLK
TP25 = testpad2:TP: Test pad; TP_SIGNAL_NAME: CHARGE_STATUS
TP26 = testpad2:TP: Test pad; TP_SIGNAL_NAME: SPI_MOSI
TP27 = testpad2:TP: Test pad; TP_SIGNAL_NAME: DISPLAY_D/!C
TP28 = testpad2:TP: Test pad; TP_SIGNAL_NAME: SPI_CS_DISPLAY
TP29 = testpad2:TP: Test pad; TP_SIGNAL_NAME: MCU_SCL
TP30 = testpad2:TP: Test pad; TP_SIGNAL_NAME: MCU_SDA
TP31 = testpad2:TP: Test pad; TP_SIGNAL_NAME: EINK_!RST
TP32 = testpad2:TP: Test pad; TP_SIGNAL_NAME: EINK_BUSY
TP33 = testpad2:TP: Test pad; TP_SIGNAL_NAME: !FLASH_WP
TP34 = testpad2:TP: Test pad; TP_SIGNAL_NAME: FRAM_WP
TP35 = testpad2:TP: Test pad; TP_SIGNAL_NAME: !FLASH_HOLD
TP36 = testpad2:TP: Test pad; TP_SIGNAL_NAME: MCU_SPI_MISO
TP37 = testpad2:TP: Test pad; TP_SIGNAL_NAME: MCU_SPI_CS
TP38 = testpad2:TP: Test pad; TP_SIGNAL_NAME: MCU_SPI_CLK
TP39 = testpad2:TP: Test pad; TP_SIGNAL_NAME: MCU_SPI_MOSI
TP40 = testpad2:TP: Test pad; TP_SIGNAL_NAME: !RTC_INT1
TP41 = testpad2:TP: Test pad; TP_SIGNAL_NAME: RTC_CLKOUT
TP42 = testpad2:TP: Test pad; TP_SIGNAL_NAME: !RTC_INT2
U1 = LCMXO2-640HC-4TG100C:LCMXO2-640HC-4TG100C-NEW: FPGA - Field Programmable Gate Array 640 LUTs 79 IO 3.3V 4 Spd Source: Datasheet <http://www.latticesemi.com/~/media/LatticeSemi/Documents/DataSheets/MachXO23/MachXO2FamilyDataSheet.pdf>; DESCRIPTION: FPGA - Field Programmable Gate Array 640 LUTs 79 IO 3.3V 4 Spd; MANUFACTURER: Lattice Semiconductor; MOUSER-LINK: https://www.mouser.com/Search/Refine.aspx?Keyword=842-XO2640HC4TG100C; MOUSER_PART_NUMBER: 842-XO2640HC4TG100C; MPN: LCMXO2-640HC-4TG100C
U2 = MastersProject:MCP73831; PARTNO: MCP73831T-2ATI/OT
U3 U5 U6 U8 U9 = MastersProject:STLQ015M33R: STLQ015M33R - Ultra Low Quiescent Current Linear Voltage Regulator Technical Specifications: Vcc: 1.5-5.5V Vout: 3.3V; PARTNO: STLQ015M33R
U4 = MastersProject:STLQ015M33R: STLQ015M33R - Ultra Low Quiescent Current Linear Voltage Regulator Technical Specifications: Vcc: 1.5-5.5V Vout: 3.3V; PARTNO: STLQ015M12R
U7 = MastersProject:STLQ015M12R: STLQ015M12R - Ultra Low Quiescent Current Linear Voltage Regulator Technical Specifications: Vcc: 1.5-5.5V Vout: 1.2V; PARTNO: STLQ015M12R
U10 = MastersProject:HDC1080; PARTNO: HDC1080DMBT
U11 = MastersProject:OPT3001; PARTNO: OPT3001DNPT
U12 = MastersProject:MSP432P401R; PARTNO: MSP432P401RIPZR
U13 = Memory-Flash:AT25SL128A
U16 = MastersProjectV2:PCF8523
U17 = MastersProjectV2:FM24CL16B
U18 = MastersProjectV2:4.2-E-INK-DISPLAY
X1 = con-cypressindustries:MINI-USB-: MINI USB-B Conector Source: www.cypressindustries.com; OC_FARNELL: unknown; OC_NEWARK: unknown; PARTNO: 10033526-N3212LF